# Altium schematic sheet KR-51_V56.SchDoc
size A4
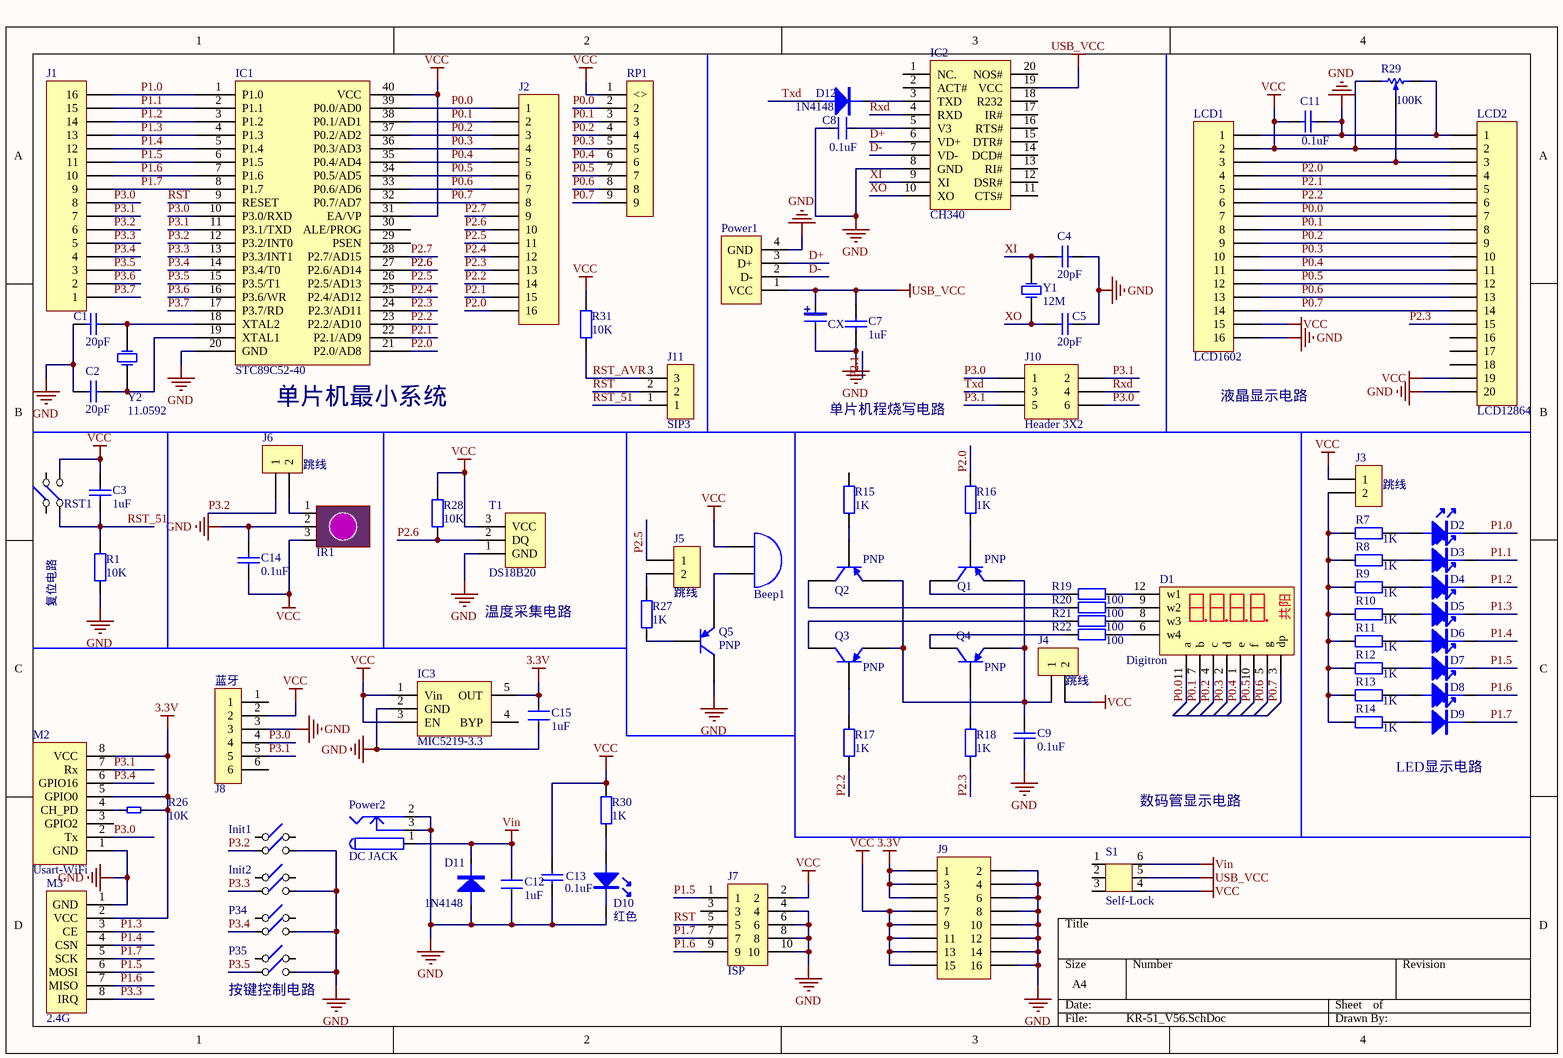
[diagram p0: KR-51_V56.SchDoc]

## Parts
Beep1  蜂鸣器  [beep]  (value not drawn)
C1  value 20pF  [0805_C]  (hidden comment: Cap_SMT)
C2  value 20pF  [0805_C]  (hidden comment: Cap_SMT)
C3  value 1uF  [0805_C]  (hidden comment: Cap_SMT)
C4  value 20pF  [0805_C]  (hidden comment: Cap_SMT)
C5  value 20pF  [0805_C]  (hidden comment: Cap_SMT)
C7  value 1uF  [0805_C]  (hidden comment: Cap_SMT)
C8  value 0.1uF  [0805C]  (hidden comment: C0805)
C9  value 0.1uF  [0805_C]  (hidden comment: Cap_SMT)
C11  value 0.1uF  [0805_C]  (hidden comment: Cap_SMT)
C12  value 1uF  [0805C]  (hidden comment: C0805)
C13  value 0.1uF  [0805_C]  (hidden comment: Cap_SMT)
C14  value 0.1uF  [0805_C]  (hidden comment: Cap_SMT)
C15  value 1uF  [0805C]  (hidden comment: C0805)
CX  C1206  [C1206_C]  (value not drawn)
D1  Digitron  [Ditigron_Pack]
D2  LED0805  [LED0805]  (value not drawn)
D3  LED0805  [LED0805]  (value not drawn)
D4  LED0805  [LED0805]  (value not drawn)
D5  LED0805  [LED0805]  (value not drawn)
D6  LED0805  [LED0805]  (value not drawn)
D7  LED0805  [LED0805]  (value not drawn)
D8  LED0805  [LED0805]  (value not drawn)
D9  LED0805  [LED0805]  (value not drawn)
D10  红色  [LED0805]
D11  1N4148  [0805D]
D12  1N4148  [0805D]
IC1  STC89C52-40  [DIP_40S]
IC2  CH340  [SSOP-20]
IC3  value MIC5219-3.3  [SOT_23_5]  (hidden comment: MIC5219_3.3)
Init1  Init0  [switch key]  (value not drawn)
Init2  Init1  [switch key]  (value not drawn)
IR1  红外接收头  [红外接收头-卧]  (value not drawn)
J1  Header 16  [HDR1X16]  (value not drawn)
J2  Header 16  [HDR1X16]  (value not drawn)
J3  跳线  [SIP2-0.254]
J4  跳线  [SIP2-0.254]
J5  跳线  [SIP2-0.254]
J6  跳线  [SIP2-0.254]
J7  ISP  [ISP]
J8  蓝牙  [SIP6-0.254]
J9  Header 8X2  [HDR2X8]  (value not drawn)
J10  Header 3X2  [HDR2X3]
J11  SIP3  [SIP3.0-0.254]
LCD1  LCD1602  [HDR1X16]
LCD2  LCD12864  [HDR1X20]
M2  Usart-WiFi  [Module_Usart-WiFi]
M3  2.4G  [Module_2.4G]
P34  (no value)  [switch key]
P35  (no value)  [switch key]
Power1  USB-B  [USB-B]  (value not drawn)
Power2  DC JACK  [DC JACK]
Q1  PNP  [SOT-23Q]
Q2  PNP  [SOT-23Q]
Q3  PNP  [SOT-23Q]
Q4  PNP  [SOT-23Q]
Q5  PNP  [SOT-23Q]
R1  value 10K  [0805_R]  (hidden comment: Res_SMT)
R7  value 1K  [0805_R]  (hidden comment: Res_SMT)
R8  value 1K  [0805_R]  (hidden comment: Res_SMT)
R9  value 1K  [0805_R]  (hidden comment: Res_SMT)
R10  value 1K  [0805_R]  (hidden comment: Res_SMT)
R11  value 1K  [0805_R]  (hidden comment: Res_SMT)
R12  value 1K  [0805_R]  (hidden comment: Res_SMT)
R13  value 1K  [0805_R]  (hidden comment: Res_SMT)
R14  value 1K  [0805_R]  (hidden comment: Res_SMT)
R15  value 1K  [0805_R]  (hidden comment: Res_SMT)
R16  value 1K  [0805_R]  (hidden comment: Res_SMT)
R17  value 1K  [0805_R]  (hidden comment: Res_SMT)
R18  value 1K  [0805_R]  (hidden comment: Res_SMT)
R19  value 100  [0805_R]  (hidden comment: Res_SMT)
R20  value 100  [0805_R]  (hidden comment: Res_SMT)
R21  value 100  [0805_R]  (hidden comment: Res_SMT)
R22  value 100  [0805_R]  (hidden comment: Res_SMT)
R26  value 10K  [R0805]  (hidden comment: R0805)
R27  value 1K  [0805_R]  (hidden comment: Res_SMT)
R28  value 10K  [0805_R]  (hidden comment: Res_SMT)
R29  100K  [WH06]
R30  value 1K  [0805_R]  (hidden comment: Res_SMT)
R31  value 10K  [0805_R]  (hidden comment: Res_SMT)
RP1  排阻9脚  [R9PIN]  (value not drawn)
RST1  switch  [switch key]  (value not drawn)
S1  Self-Lock  [Self-Lock_2.54]
T1  DS18B20  [T0_92_2.54]
Y1  12M  [HC-49S]
Y2  11.0592  [HC-49S]

## Nets
3.3V: C15.1 IC3.5(OUT) J9.1 J9.3 J9.5 M2.5(GPIO0) M2.8(VCC) M3.2(VCC) R26.2
GND: C1.2 C2.2 C4.2 C5.2 C7.2 C8.1 C9.1 C11.2 C12.2 C13.1 C14.2 C15.2 CX.2 D10.K D11.A IC1.20(GND) IC2.8(GND) IC3.2(GND) Init1.2(NO) Init2.2(NO) IR1.2(GND) J7.4 J7.6 J7.8 J7.10 J8.3 J9.2 J9.4 J9.6 J9.8 J9.10 J9.12 J9.14 J9.16 LCD1.1 LCD1.16 LCD2.1 LCD2.20 M2.1(GND) M3.1(GND) P34.2(NO) P35.2(NO) Power1.4(GND) Power2.2 Power2.3 Q5.C R1.1 R29.3 T1.1(GND)
USB_VCC: C7.1 CX.1 IC2.19(VCC) Power1.1(VCC) S1.5
VCC: Beep1.2(B) C3.1 C11.1 C13.2 C14.1 IC1.31(EA/VP) IC1.40(VCC) IC3.1(Vin) IC3.3(EN) IR1.3(VCC) J3.1 J4.2 J7.2 J8.2 J9.7 J9.9 J9.11 J9.13 J9.15 LCD1.2 LCD1.15 LCD2.2 LCD2.19 R28.2 R29.1 R30.1 R31.2 RP1.1(<>) RST1.2(NO) S1.4 T1.3(VCC)
Vin: C12.1 D11.K Power2.1 S1.6
D+: IC2.6(VD+) Power1.3(D+)
D-: IC2.7(VD-) Power1.2(D-)
P0.0: D1.11(a) IC1.39(P0.0/AD0) J2.1 LCD1.7 LCD2.7 RP1.2
P0.1: D1.7(b) IC1.38(P0.1/AD1) J2.2 LCD1.8 LCD2.8 RP1.3
P0.2: D1.4(c) IC1.37(P0.2/AD2) J2.3 LCD1.9 LCD2.9 RP1.4
P0.3: D1.2(d) IC1.36(P0.3/AD3) J2.4 LCD1.10 LCD2.10 RP1.5
P0.4: D1.1(e) IC1.35(P0.4/AD4) J2.5 LCD1.11 LCD2.11 RP1.6
P0.5: D1.10(f) IC1.34(P0.5/AD5) J2.6 LCD1.12 LCD2.12 RP1.7
P0.6: D1.5(g) IC1.33(P0.6/AD6) J2.7 LCD1.13 LCD2.13 RP1.8
P0.7: D1.3(dp) IC1.32(P0.7/AD7) J2.8 LCD1.14 LCD2.14 RP1.9
P1.0: D2.K IC1.1(P1.0) J1.16
P1.1: D3.K IC1.2(P1.1) J1.15
P1.2: D4.K IC1.3(P1.2) J1.14
P1.3: D5.K IC1.4(P1.3) J1.13 M3.3(CE)
P1.4: D6.K IC1.5(P1.4) J1.12 M3.4(CSN)
P1.5: D7.K IC1.6(P1.5) J1.11 J7.1 M3.6(MOSI)
P1.6: D8.K IC1.7(P1.6) J1.10 J7.9 M3.7(MISO)
P1.7: D9.K IC1.8(P1.7) J1.9 J7.7 M3.5(SCK)
P2.0: IC1.21(P2.0/AD8) J2.16 LCD1.4 LCD2.4 R16.2
P2.1: IC1.22(P2.1/AD9) J2.15 LCD1.5 LCD2.5
P2.2: IC1.23(P2.2/AD10) J2.14 LCD1.6 LCD2.6 R17.1
P2.3: IC1.24(P2.3/AD11) J2.13 LCD2.15 R18.1
P2.4: IC1.25(P2.4/AD12) J2.12
P2.5: IC1.26(P2.5/AD13) J2.11 J5.1
P2.6: IC1.27(P2.6/AD14) J2.10 R28.1 T1.2(DQ)
P2.7: IC1.28(P2.7/AD15) J2.9
P3.0: IC1.10(P3.0/RXD) J1.8 J8.4 J10.1 J10.6 M2.2(Tx)
P3.1: IC1.11(P3.1/TXD) J1.7 J8.5 J10.2 J10.5 M2.7(Rx)
P3.2: IC1.12(P3.2/INT0) Init1.1(COMMON) J1.6 J6.1
P3.3: IC1.13(P3.3/INT1) Init2.1(COMMON) J1.5 M3.8(IRQ)
P3.4: IC1.14(P3.4/T0) J1.4 M2.6(GPIO16) P34.1(COMMON)
P3.5: IC1.15(P3.5/T1) J1.3 P35.1(COMMON)
P3.6: IC1.16(P3.6/WR) J1.2
P3.7: IC1.17(P3.7/RD) J1.1
RST: IC1.9(RESET) J7.5 J11.2
RST_51: C3.2 J11.1 R1.2 RST1.1(COMMON)
RST_AVR: J11.3 R31.1
Rxd: IC2.4(RXD) J10.4
Txd: D12.A J10.3
XI: C4.1 IC2.9(XI) Y1.2
XO: C5.1 IC2.10(XO) Y1.1
NetBeep1_1: Beep1.1(A) Q5.E
NetC1_1: C1.1 IC1.18(XTAL2) Y2.1
NetC2_1: C2.1 IC1.19(XTAL1) Y2.2
NetC8_2: C8.2 IC2.5(V3)
NetC9_2: C9.2 J4.1 Q1.E Q2.E Q3.E Q4.E
NetD1_6: D1.6(w4) R22.2
NetD1_8: D1.8(w3) R21.2
NetD1_9: D1.9(w2) R20.2
NetD1_12: D1.12(w1) R19.2
NetD2_A: D2.A R7.2
NetD3_A: D3.A R8.2
NetD4_A: D4.A R9.2
NetD5_A: D5.A R10.2
NetD6_A: D6.A R11.2
NetD7_A: D7.A R12.2
NetD8_A: D8.A R13.2
NetD9_A: D9.A R14.2
NetD10_A: D10.A R30.2
NetD12_K: D12.K IC2.3(TXD)
NetIR1_1: IR1.1(IN) J6.2
NetJ3_2: J3.2 R7.1 R8.1 R9.1 R10.1 R11.1 R12.1 R13.1 R14.1
NetJ5_2: J5.2 R27.2
NetLCD1_3: LCD1.3 LCD2.3 R29.2
NetM2_4: M2.4(CH_PD) R26.1
NetQ1_B: Q1.B R16.1
NetQ1_C: Q1.C R19.1
NetQ2_B: Q2.B R15.1
NetQ2_C: Q2.C R20.1
NetQ3_B: Q3.B R17.2
NetQ3_C: Q3.C R21.1
NetQ4_B: Q4.B R18.2
NetQ4_C: Q4.C R22.1
NetQ5_B: Q5.B R27.1

Not connected (* = marked no-connect by the designer): IC1 29(PSEN) 30(ALE/PROG); IC2 1(NC.) 2(ACT#) 11(CTS#) 12(DSR#) 13(RI#) 14(DCD#) 15(DTR#) 16(RTS#) 17(IR#) 18(R232) 20(NOS#); IC3 4(BYP); J7 3; J8 1 6; LCD2 16 17 18; M2 3(GPIO2); R15 2; S1 1 2 3

## Notes on the sheet
- (near IC1) 单片机最小系统
- (near LCD1) 液晶显示电路
- 单片机程烧写电路
- (near R1) 复位电路
- 温度采集电路
- 数码管显示电路
- LED显示电路
- (near P35) 按键控制电路
- (in symbol Digitron) 共阳; .

## Library data of the parts
C1-C5 C7 C9 C11 C13 C14 = Cap_SMT: Capacitor
CX = 钽电容1206: Value: 10uF
D10 = LED0805
D11 D12 = 0805D
Init1 Init2 P34 P35 = switch
J1 J2 LCD1 = Header 16: Header, 16-Pin; LatestRevisionDate: 17-Jul-2002; LatestRevisionNote: Re-released for DXP Platform.; Publisher: Altium Limited
J3-J6 = SIP2-0.254
J8 = SIP6-0.254
J9 = Header 8X2: Header, 8-Pin, Dual row; LatestRevisionDate: 17-Jul-2002; LatestRevisionNote: Re-released for DXP Platform.; Publisher: Altium Limited
J10 = Header 3X2: Header, 3-Pin, Dual row; LatestRevisionDate: 17-Jul-2002; LatestRevisionNote: Re-released for DXP Platform.; Publisher: Altium Limited
J11 = SIP3.0-0.254
LCD2 = Header 20: Header, 20-Pin; LatestRevisionDate: 17-Jul-2002; LatestRevisionNote: Re-released for DXP Platform.; Publisher: Altium Limited
M2 = Module_Usart-WiFi
M3 = Module_2.4G
R1 R7-R22 R27 R28 R30 R31 = Res_SMT: Resistor
R29 = 3362R
Y1 Y2 = XTAL
IC2 = CH340: VALUE: CH340